# EAGLE design glucoschema (EAGLE 9.6.1)
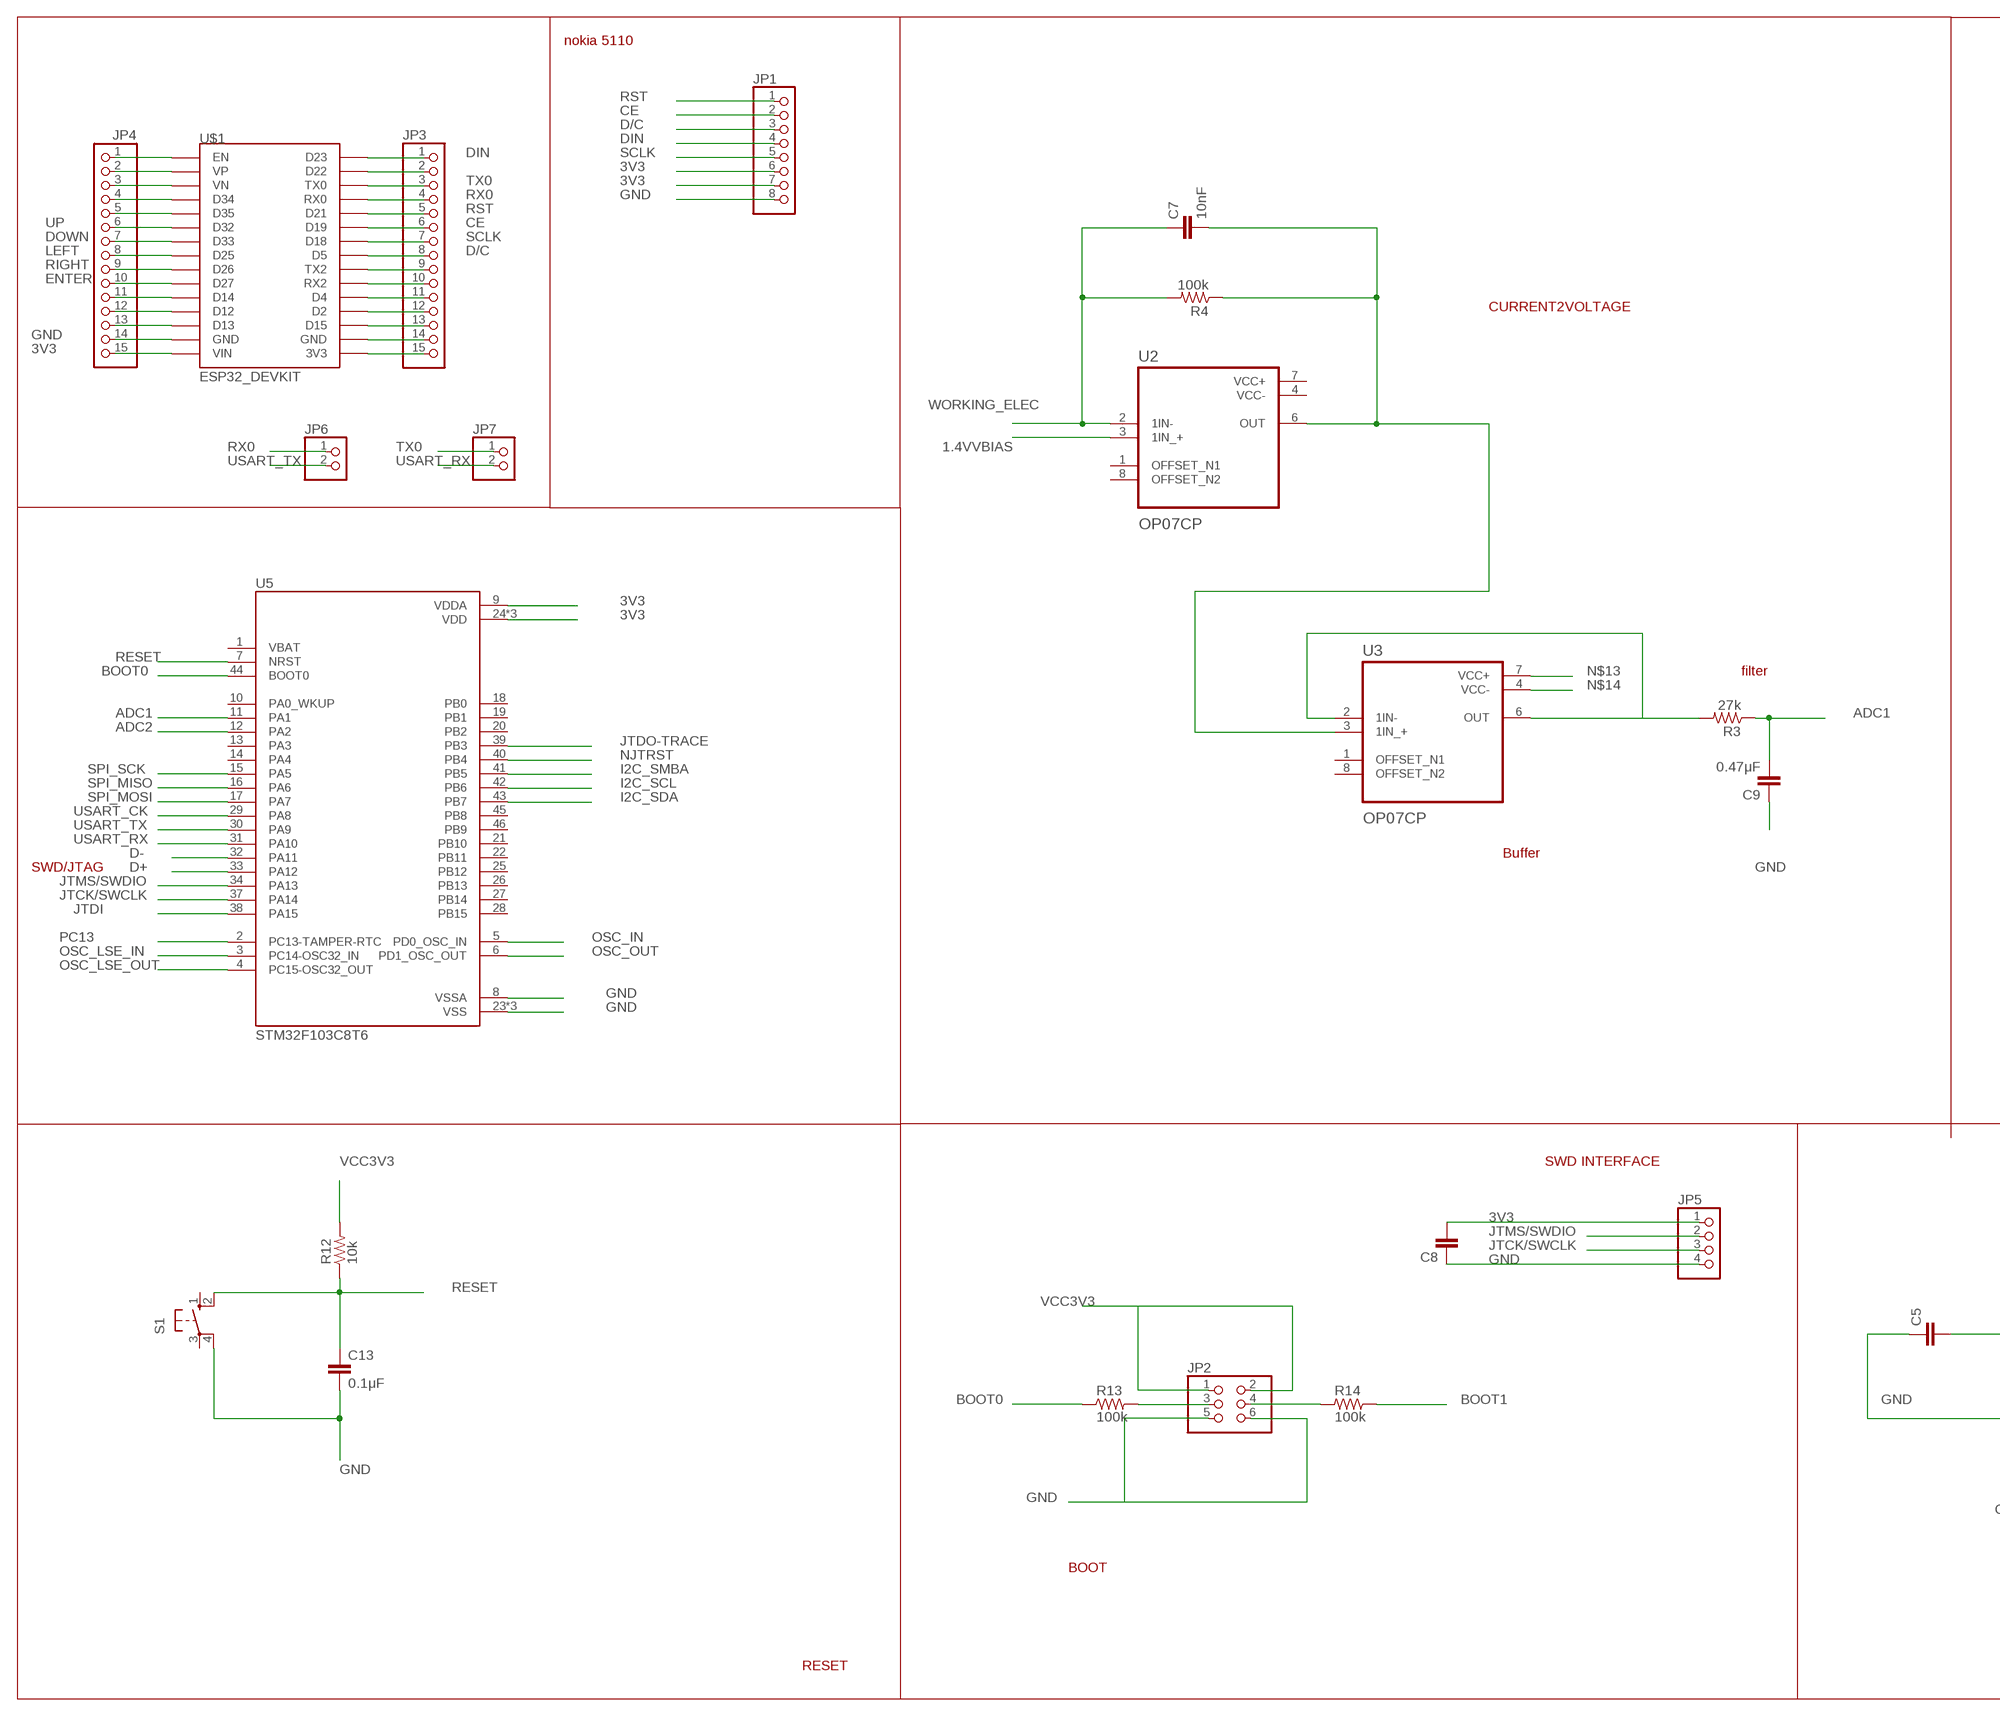
[diagram p0: schematic, sheet 1, part 1 of 2]
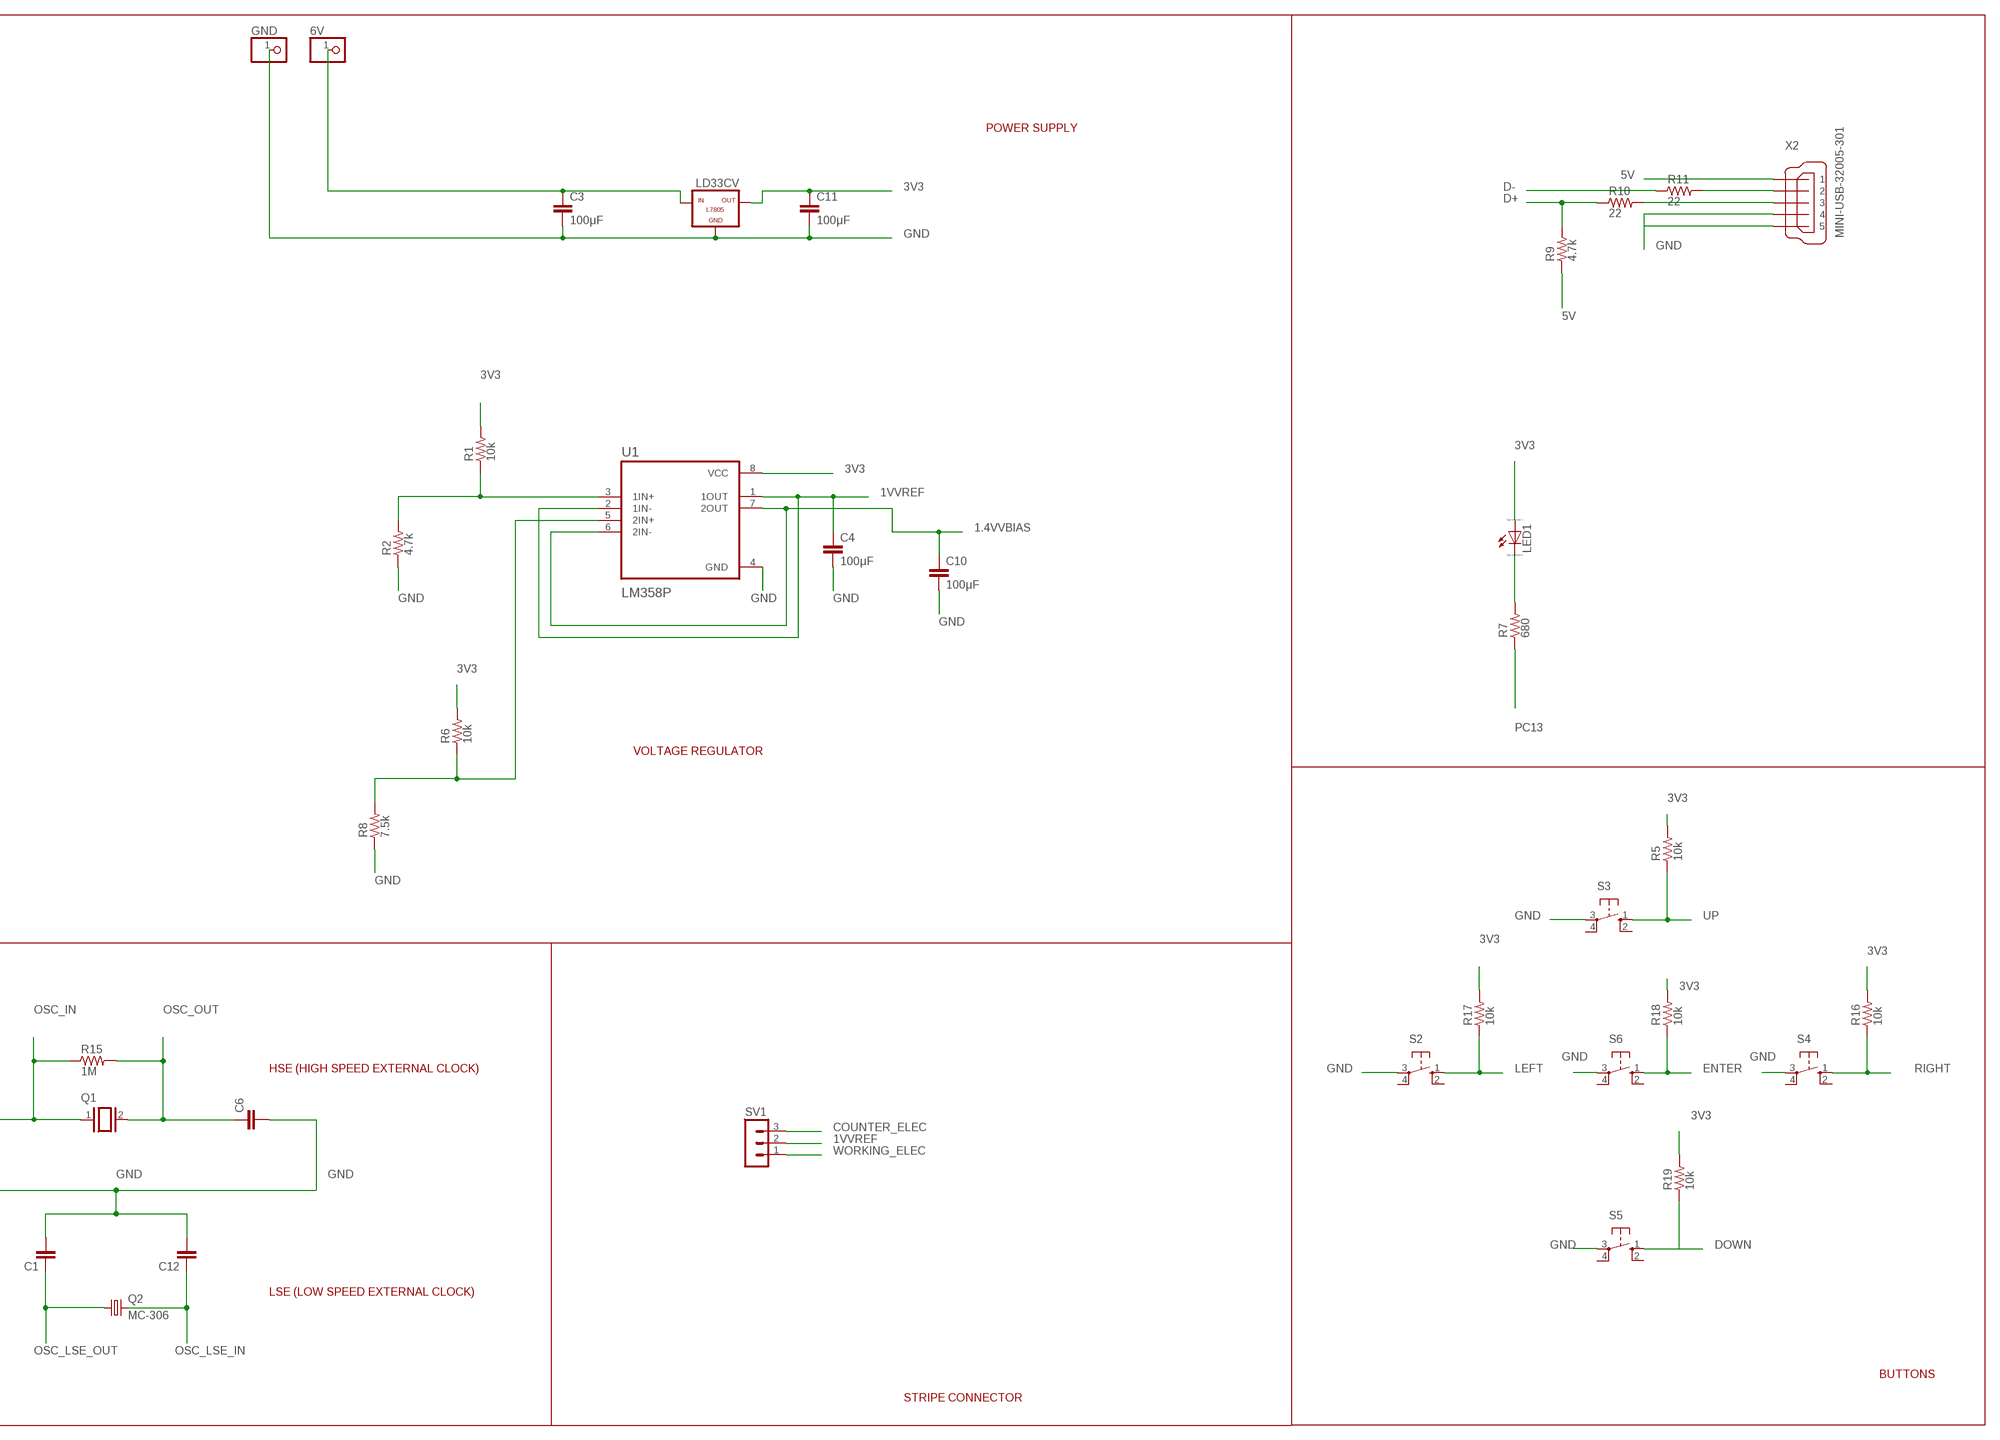
[diagram p1: schematic, sheet 1, part 2 of 2]

## Parts
6V  PINHD-1X1  [1X01]
C1  C2.5/4  [C2.5-4]
C3  100μF  C2.5/4  [C2.5-4]
C4  100μF  C2.5/4  [C2.5-4]
C5  C2.5/4  [C2.5-4]
C6  C2.5/4  [C2.5-4]
C7  10nF  C2.5/4  [C2.5-4]
C8  C2.5/4  [C2.5-4]
C9  0.47μF  C2.5/4  [C2.5-4]
C10  100μF  C2.5/4  [C2.5-4]
C11  100μF  C2.5/4  [C2.5-4]
C12  C2.5/4  [C2.5-4]
C13  0.1μF  C2.5/4  [C2.5-4]
GND  PINHD-1X1  [1X01]
JP1  PINHD-1X8  [1X08]
JP2  PINHD-2X3  [2X03]
JP3  PINHD-1X15  [1X15]
JP4  PINHD-1X15  [1X15]
JP5  PINHD-1X4  [1X04]
JP6  PINHD-1X2  [1X02]
JP7  PINHD-1X2  [1X02]
LD33CV  -L7805  [L7805]
LED1  LED_E  [LED_1206]
Q1  XTAL/S  [QS]
Q2  MC-306  [MC-306]
R1  10k  R_0805  [R0805]
R2  4.7k  R_0805  [R0805]
R3  27k  R_0805  [R0805]
R4  100k  R_0805  [R0805]
R5  10k  R_0805  [R0805]
R6  10k  R_0805  [R0805]
R7  680  R_0805  [R0805]
R8  7.5k  R_0805  [R0805]
R9  4.7k  R_0805  [R0805]
R10  22  R_0805  [R0805]
R11  22  R_0805  [R0805]
R12  10k  R_0805  [R0805]
R13  100k  R_0805  [R0805]
R14  100k  R_0805  [R0805]
R15  1M  R_0805  [R0805]
R16  10k  R_0805  [R0805]
R17  10k  R_0805  [R0805]
R18  10k  R_0805  [R0805]
R19  10k  R_0805  [R0805]
S1  10-XX  [B3F-10XX]
S2  10-XX  [B3F-10XX]
S3  10-XX  [B3F-10XX]
S4  10-XX  [B3F-10XX]
S5  10-XX  [B3F-10XX]
S6  10-XX  [B3F-10XX]
SV1  MA03-1  [MA03-1]
U1  LM358P  [DIP794W45P254L959H508Q8]
U2  OP07CP  [DIP794W45P254L959H508Q8]
U3  OP07CP  [DIP794W45P254L959H508Q8]
U5  STM32F103C8T6  [QFP50P900X900X160-48N]
U$1  ESP32_DEVKIT  [ESP32_DEVKIT]
X2  MINI-USB-32005-301  [32005-301]

## Nets
1.4VVBIAS: C10.1 U1.6(2IN-) U1.7(2OUT) U2.3(1IN_+)
1VVREF: C4.1 SV1.2 U1.1(1OUT) U1.2(1IN-)
3V1: LED1.C R7.2
3V3: C8.2 C11.1 JP1.6 JP1.7 JP4.15 JP5.1 LD33CV.OUT LED1.A R1.2 R5.2 R6.2 R16.2 R17.2 R18.2 R19.2 U1.8(VCC) U5.9(VDDA) U5.24(VDD) U5.36(VDD) U5.48(VDD) U$1.VIN
5V: R9.1 X2.1
ADC1: C9.2 R3.1 U5.11(PA1)
ADC2: U5.12(PA2)
BOOT0: R13.1 U5.44(BOOT0)
BOOT1: R14.2
CE: JP1.2 JP3.6 U$1.D19
COUNTER_ELEC: SV1.3
D+: R9.2 R10.1 U5.33(PA12)
D-: R11.1 U5.32(PA11)
D/C: JP1.3 JP3.8 U$1.D5
DIN: JP1.4 JP3.1 U$1.D23
DOWN: JP4.7 R19.1 S5.1(S) U$1.D33
ENTER: JP4.10 R18.1 S6.1(S) U$1.D27
GND: C1.2 C3.2 C4.2 C5.1 C6.2 C8.1 C9.1 C10.2 C11.2 C12.2 C13.2 GND.1 JP1.8 JP2.6 JP4.14 JP5.4 LD33CV.GND R2.1 R8.1 S1.4(P1) S2.3(P) S3.3(P) S4.3(P) S5.3(P) S6.3(P) U1.4(GND) U5.8(VSSA) U5.23(VSS) U5.35(VSS) U5.47(VSS) U$1.GND@1(GND) X2.4
I2C_SCL: U5.42(PB6)
I2C_SDA: U5.43(PB7)
I2C_SMBA: U5.41(PB5)
JTCK/SWCLK: JP5.3 U5.37(PA14)
JTDI: U5.38(PA15)
JTDO-TRACE: U5.39(PB3)
JTMS/SWDIO: JP5.2 U5.34(PA13)
LEFT: JP4.8 R17.1 S2.1(S) U$1.D25
N$1: R1.1 R2.2 U1.3(1IN+)
N$2: JP2.3 R13.2
N$3: JP2.4 R14.1
N$4: JP2.5
N$5: R6.1 R8.2 U1.5(2IN+)
N$6: JP2.1
N$8: JP4.13 U$1.D13
N$9: C7.2 R4.1 U2.6(OUT) U3.3(1IN_+)
N$10: JP4.12 U$1.D12
N$11: JP4.11 U$1.D14
N$13: U3.7(VCC+)
N$14: U3.4(VCC-)
N$19: JP4.5 U$1.D35
N$20: JP4.4 U$1.D34
N$21: JP4.3 U$1.VN
N$22: JP4.2 U$1.VP
N$23: JP4.1 U$1.EN
N$30: JP3.9 U$1.TX2
N$31: JP3.10 U$1.RX2
N$32: JP3.11 U$1.D4
N$33: JP3.12 U$1.D2
N$34: JP3.13 U$1.D15
N$35: JP3.14 U$1.GND@2(GND)
N$36: JP3.15 U$1.3V3
N$38: R11.2 X2.2
N$39: R10.2 X2.3
N$40: 6V.1 C3.1 LD33CV.IN
N$41: X2.5
N$1235AZE21: R3.2 U3.2(1IN-) U3.6(OUT)
NJTRST: U5.40(PB4)
OSC_IN: C5.2 Q1.1 R15.1 U5.5(PD0_OSC_IN)
OSC_LSE_IN: C12.1 Q2.4 U5.3(PC14-OSC32_IN)
OSC_LSE_OUT: C1.1 Q2.1 U5.4(PC15-OSC32_OUT)
OSC_OUT: C6.1 Q1.2 R15.2 U5.6(PD1_OSC_OUT)
PC13: R7.1 U5.2(PC13-TAMPER-RTC)
RESET: C13.1 R12.1 S1.2(S1) U5.7(NRST)
RIGHT: JP4.9 R16.1 S4.1(S) U$1.D26
RST: JP1.1 JP3.5 U$1.D21
RX0: JP3.4 JP6.1 U$1.RX0
SCL: JP3.2 U$1.D22
SCLK: JP1.5 JP3.7 U$1.D18
SPI_MISO: U5.16(PA6)
SPI_MOSI: U5.17(PA7)
SPI_SCK: U5.15(PA5)
TX0: JP3.3 JP7.1 U$1.TX0
UP: JP4.6 R5.1 S3.1(S) U$1.D32
USART_CK: U5.29(PA8)
USART_RX: JP7.2 U5.31(PA10)
USART_TX: JP6.2 U5.30(PA9)
VCC3V3: JP2.2 R12.2
WORKING_ELEC: C7.1 R4.2 SV1.1 U2.2(1IN-)
Unconnected: S1.1(S) S1.3(P) S2.2(S1) S2.4(P1) S3.2(S1) S3.4(P1) S4.2(S1) S4.4(P1) S5.2(S1) S5.4(P1) S6.2(S1) S6.4(P1) U2.1(OFFSET_N1) U2.8(OFFSET_N2) U3.1(OFFSET_N1) U3.8(OFFSET_N2) U5.1(VBAT) U5.10(PA0_WKUP) U5.13(PA3) U5.14(PA4) U5.18(PB0) U5.19(PB1) U5.20(PB2) U5.21(PB10) U5.22(PB11) U5.25(PB12) U5.26(PB13) U5.27(PB14) U5.28(PB15) U5.45(PB8) U5.46(PB9)

## Notes on the sheet
- nokia 5110
- POWER SUPPLY
- CURRENT2VOLTAGE
- filter
- Buffer
- SWD/JTAG
- VOLTAGE REGULATOR
- SWD INTERFACE
- HSE (HIGH SPEED EXTERNAL CLOCK)
- LSE (LOW SPEED EXTERNAL CLOCK)
- BOOT
- BUTTONS
- RESET | STRIPE CONNECTOR

## Power pins joined to a net without a drawn wire
VCC+: U2.7(VCC+)
VCC-: U2.4(VCC-)

## Library data of the parts
6V GND = pinhead:PINHD-1X1: PIN HEADER
C1 C3-C13 = capacitor-wima:C: CAPACITOR naming: grid - package width
JP1 = pinhead:PINHD-1X8: PIN HEADER
JP2 = pinhead:PINHD-2X3: PIN HEADER
JP3 JP4 = pinhead:PINHD-1X15: PIN HEADER
JP5 = pinhead:PINHD-1X4: PIN HEADER
JP6 JP7 = pinhead:PINHD-1X2: PIN HEADER
LD33CV = 7805:-L7805
LED1 = eagle-ltspice:LED_E: LED Source: http://www.osram.convergy.de Source: www.luxeon.com Source: www.kingbright.com; SPICEMODEL: NONE; SPICEPREFIX: D; SPICETYPE: diode
Q1 = special:XTAL/S: CRYSTAL
Q2 = crystal:MC-306: kHz RANGE CRYSTAL UNIT SMD Source: MC-306_405_406_E07X.PDF Homepage <http://www.epsontoyocom.co.jp>; MPN: MC-306 60.0KHZ 100PPM ,12.5PF; OC_FARNELL: 1278040; OC_NEWARK: 31M5576
R1-R19 = rc-master-smd:R_: RESISTOR
S1-S6 = switch-omron:10-XX: OMRON SWITCH; MPN: B3F-1000; OC_FARNELL: 176432; OC_NEWARK: 36M3542
SV1 = con-lstb:MA03-1: PIN HEADER; OC_FARNELL: unknown; OC_NEWARK: unknown
U1 = LM358P:LM358P: Check prices <https://snapeda.com/parts/LM358P/Texas%20Instruments/view-part/?ref=eda>; ARROW_ELECTRONICS-PURCHASE-URL: https://snapeda.com/shop?store=Arrow+Electronics&id=559457; AVAILABILITY: Good; DESCRIPTION: Dual standard operational amplifier 8-PDIP 0 to 70; DIGIKEY-PURCHASE-URL: https://snapeda.com/shop?store=DigiKey&id=559457; MF: Texas Instruments; MOUSER-PURCHASE-URL: https://snapeda.com/shop?store=Mouser&id=559457; MP: LM358P; PACKAGE: PDIP-8 Texas; PRICE: None; TEXAS_INSTRUMENTS-PURCHASE-URL: https://snapeda.com/shop?store=Texas+Instruments&id=559457
U2 U3 = OP07CP:OP07CP: Buy Part <https://snapeda.com/parts/OP07CP/Texas%20Instruments/view-part/?ref=eda>; AVAILABILITY: Good; DESCRIPTION: Low-Offset voltage (0.25mV) single operational amplifier 8-PDIP 0 to 70; DIGIKEY-PURCHASE-URL: https://snapeda.com/shop?store=DigiKey&id=558076; MF: Texas Instruments; MOUSER-PURCHASE-URL: https://snapeda.com/shop?store=Mouser&id=558076; MP: OP07CP; PACKAGE: PDIP-8 Texas Instruments; PRICE: None; TEXAS_INSTRUMENTS-PURCHASE-URL: https://snapeda.com/shop?store=Texas+Instruments&id=558076
U5 = STM32F103C8T6:STM32F103C8T6: Mainstream Performance line, ARM Cortex-M3 MCU with 64 Kbytes Flash, 72 MHz CPU, motor control, USB and CAN; AVAILABILITY: Unavailable; DESCRIPTION: ARM® Cortex®-M3 STM32F1 Microcontroller IC 32-Bit 72MHz 64KB (64K x 8) FLASH 48-LQFP (7x7); MF: STMicroelectronics; MP: STM32F103C8T6; PACKAGE: LQFP-48 STMicroelectronics; PRICE: None
U$1 = DOIT_ESP32_DEVKIT:ESP32_DEVKIT: ESP32 DEVKIT BOARD
X2 = con-cypressindustries:MINI-USB-: MINI USB-B Conector Source: www.cypressindustries.com; OC_FARNELL: unknown; OC_NEWARK: unknown

## Board
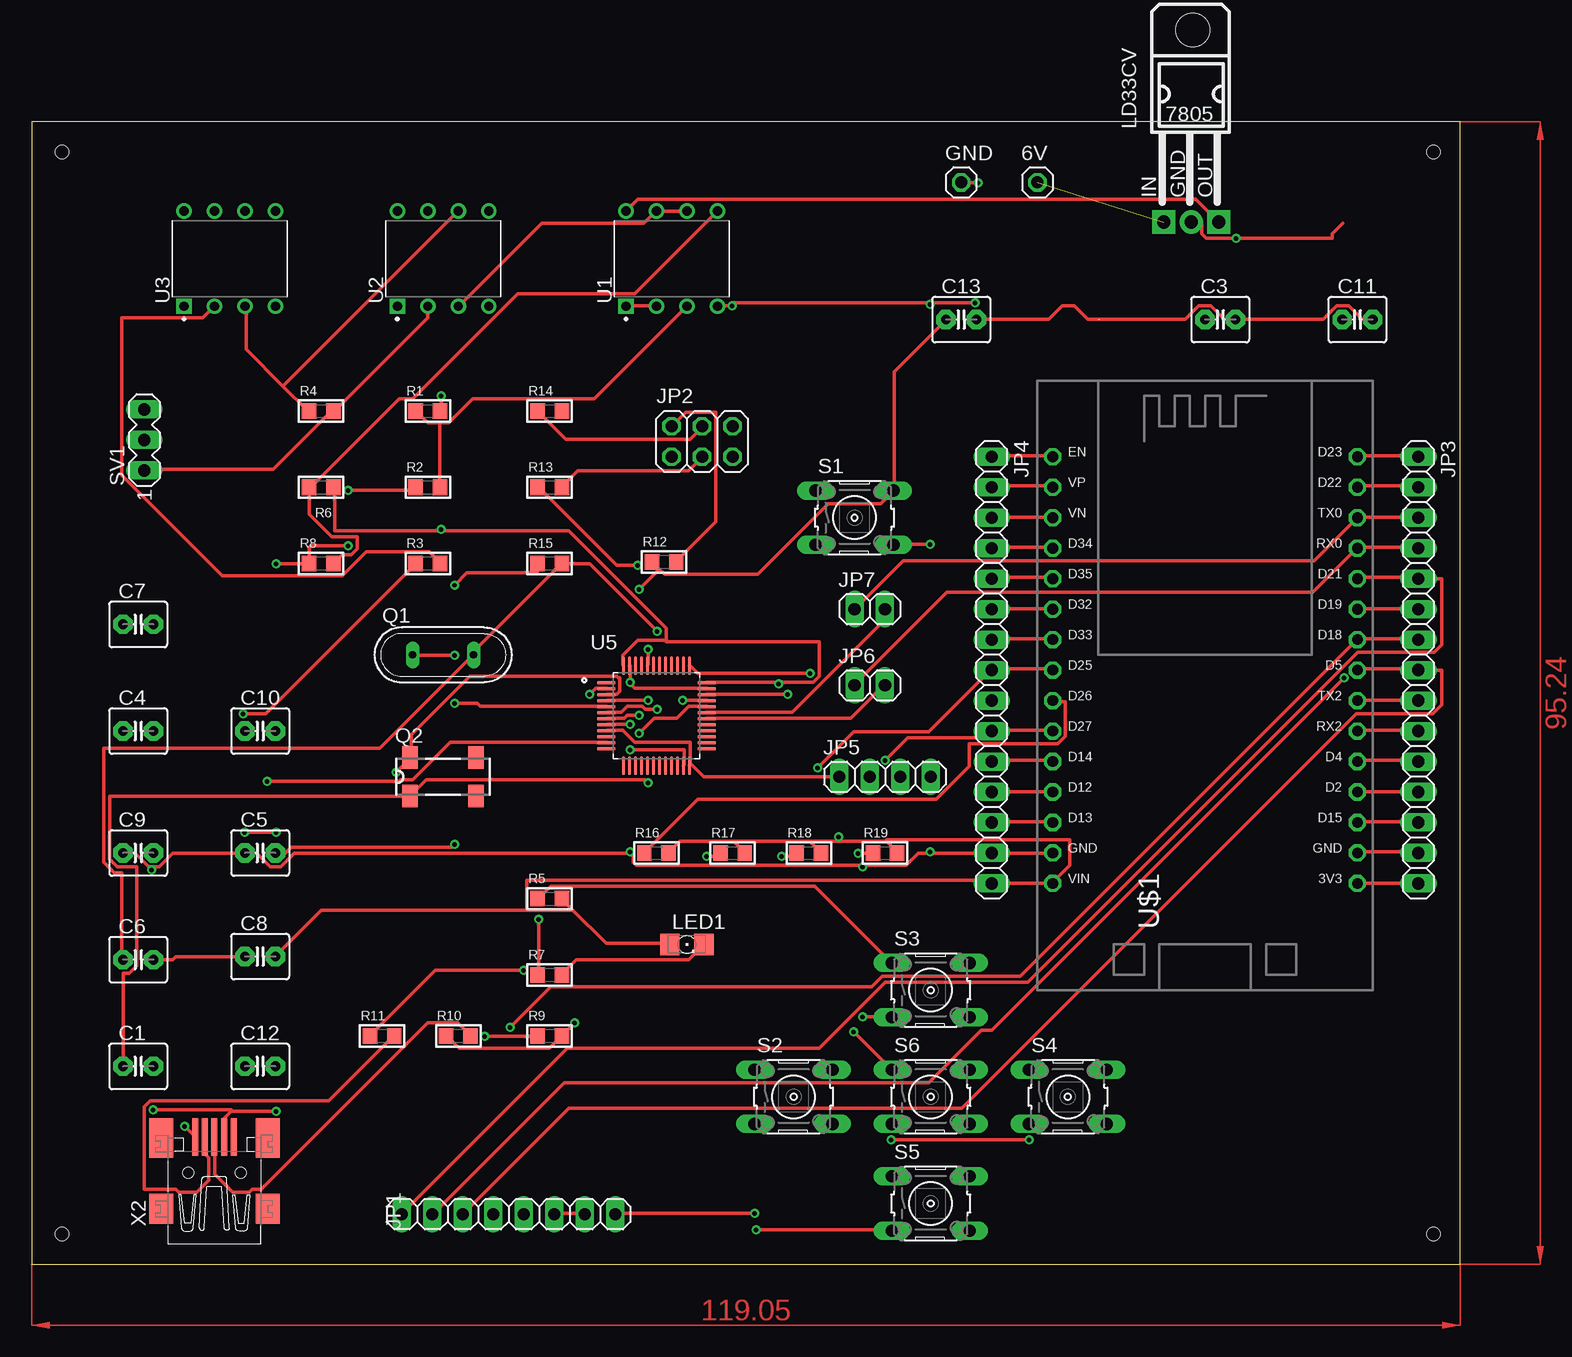
[diagram p2: board, top side]
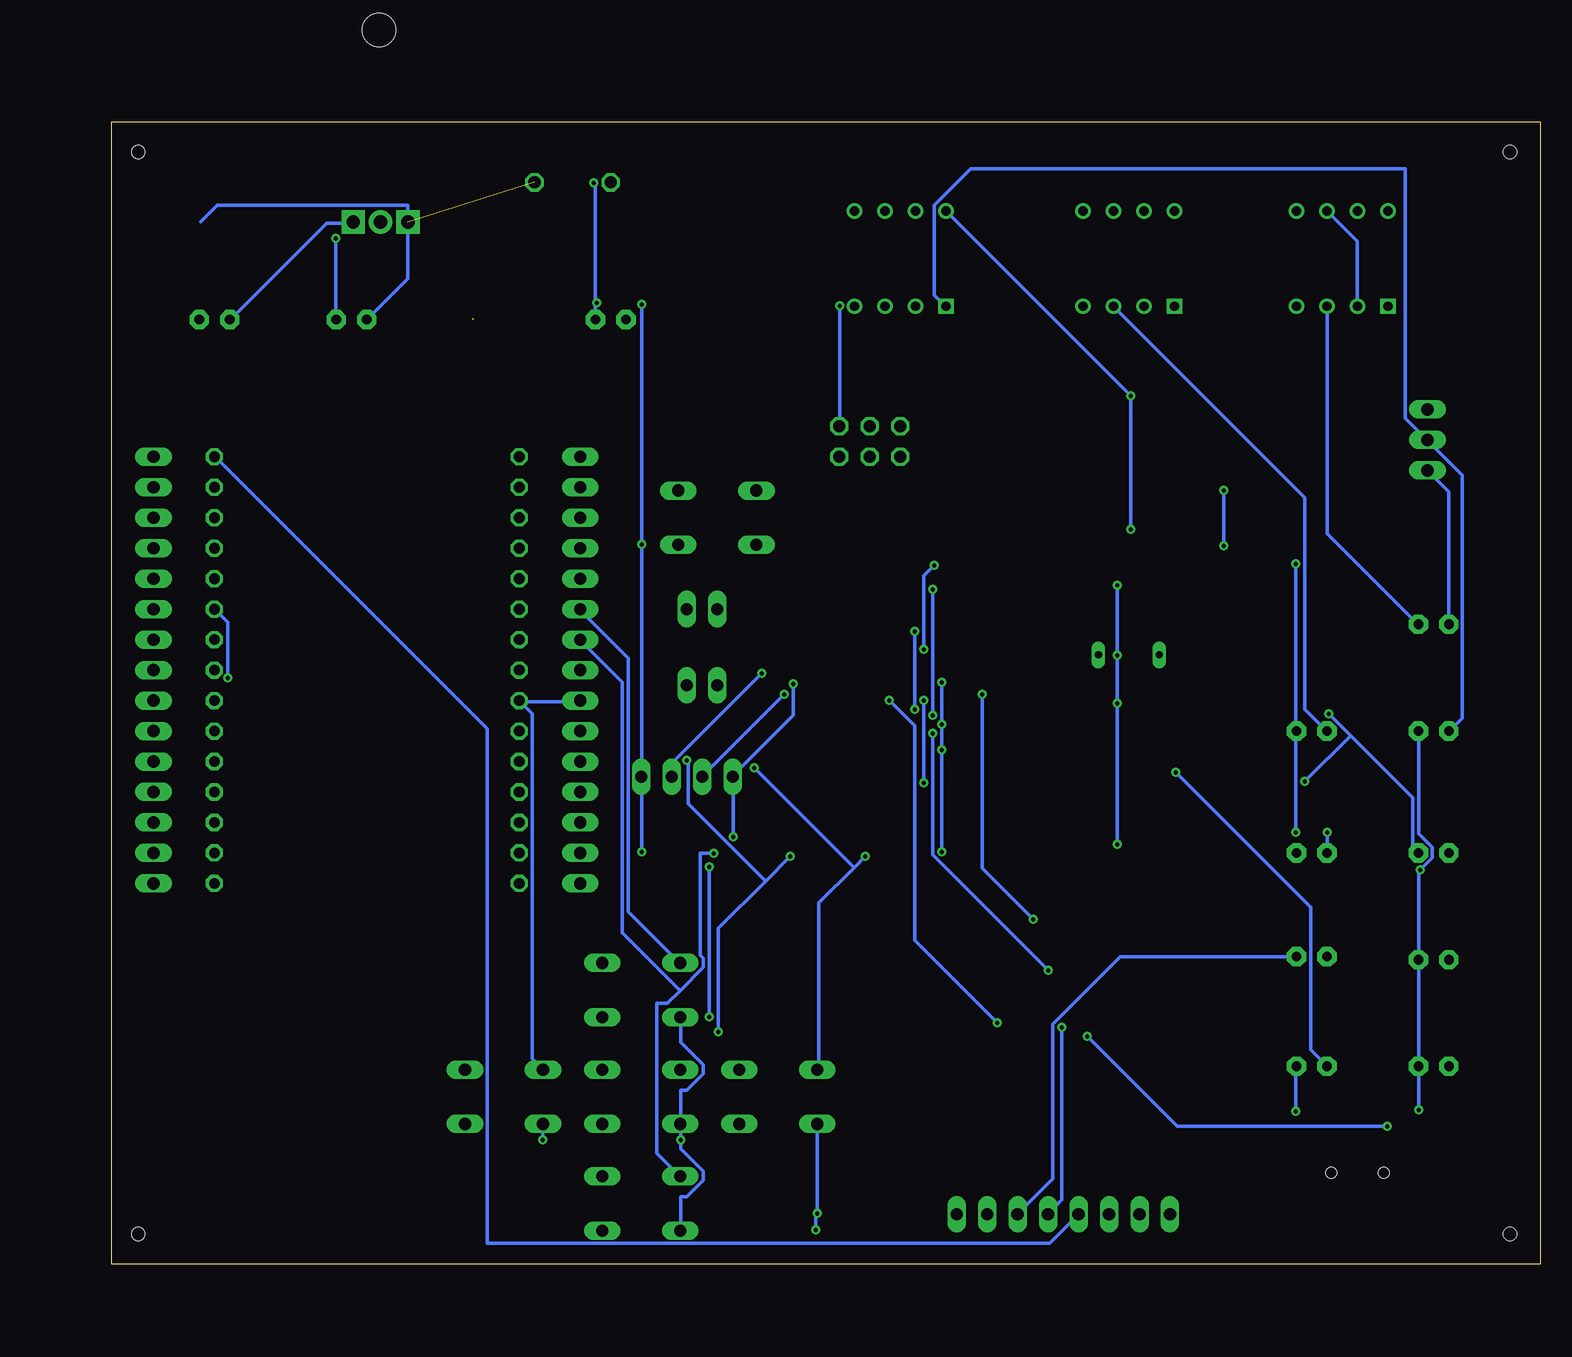
[diagram p3: board, bottom side, seen from below]

Size 119.05 x 95.24 mm. Coordinates in mm from the lower left corner, seen from the top.
Outline: 0,0 119.05,0 119.05,95.24 0,95.24 0,0
Copper layers (1*16): Top 0.035mm / dielectric 1.5mm / Bottom 0.035mm
Design rules "default *": minimum track width 0.3mm, minimum drill 0.35mm, track to track 6mil, track to pad 6mil, pad to pad 6mil, via to via 6mil, smd to smd 6mil, copper to edge 40mil, drill to drill 6mil, minimum pad ring 10mil, minimum via ring 8mil, stop-mask expansion 4mil, vias tented up to drill 0mil, thermal gap 10mil
Holes 1.1 mm at 2.54,92.71 2.54,2.54 116.84,2.54 116.84,92.71

### Footprints (pad centres in the part's own frame; a part is rotated, then mirrored left to right if it is on the bottom)
1X01 = drill 1.016 octagon: 1 0,0
C2.5-4 = drill 0.813 pad 1.6 octagon: 1 -1.27,0; 2 1.27,0
1X08 = drill 1.016 long: 1 -8.89,0; 2 -6.35,0; 3 -3.81,0; 4 -1.27,0; 5 1.27,0; 6 3.81,0; 7 6.35,0; 8 8.89,0
2X03 = drill 1.016 octagon: 1 -2.54,-1.27; 2 -2.54,1.27; 3 0,-1.27; 4 0,1.27; 5 2.54,-1.27; 6 2.54,1.27
1X15 = drill 1.016 long: 1 -17.78,0; 2 -15.24,0; 3 -12.7,0; 4 -10.16,0; 5 -7.62,0; 6 -5.08,0; 7 -2.54,0; 8 0,0; 9 2.54,0; 10 5.08,0; 11 7.62,0; 12 10.16,0; 13 12.7,0; 14 15.24,0; 15 17.78,0
1X04 = drill 1.016 long: 1 -3.81,0; 2 -1.27,0; 3 1.27,0; 4 3.81,0
1X02 = drill 1.016 long: 1 -1.27,0; 2 1.27,0
L7805 = drill 1.1 pad 1.93: GND 0.127,-9.652 | drill 1.1 pad 1.93 square: IN -2.159,-9.652; OUT 2.413,-9.652 | hole 2.8: 0.254,6.35
LED_1206 = smd 1.6 x 1.803: A -1.422,0; C 1.422,0
QS = drill 0.61 long: 1 -2.54,0; 2 2.54,0
MC-306 = smd 1.3 x 1.9: 1 -2.75,-1.6; 2 2.75,-1.6; 3 2.75,1.6; 4 -2.75,1.6
R0805 = smd 1.2 x 1.3: 1 -1.016,0; 2 1.016,0
B3F-10XX = drill 1.016 long: 1 -3.251,2.261; 2 3.251,2.261; 3 -3.251,-2.261; 4 3.251,-2.261
MA03-1 = drill 1.016 long: 1 -2.54,0; 2 0,0; 3 2.54,0
DIP794W45P254L959H508Q8 = drill 0.78 pad 1.13 square: 1 -3.97,3.81 | drill 0.78 pad 1.13: 2 -3.97,1.27; 3 -3.97,-1.27; 4 -3.97,-3.81; 5 3.97,-3.81; 6 3.97,-1.27; 7 3.97,1.27; 8 3.97,3.81
QFP50P900X900X160-48N = smd 1.56 x 0.28: 1 -4.18,2.75; 2 -4.18,2.25; 3 -4.18,1.75; 4 -4.18,1.25; 5 -4.18,0.75; 6 -4.18,0.25; 7 -4.18,-0.25; 8 -4.18,-0.75; 9 -4.18,-1.25; 10 -4.18,-1.75; 11 -4.18,-2.25; 12 -4.18,-2.75; 25 4.18,-2.75; 26 4.18,-2.25; 27 4.18,-1.75; 28 4.18,-1.25; 29 4.18,-0.75; 30 4.18,-0.25; 31 4.18,0.25; 32 4.18,0.75; 33 4.18,1.25; 34 4.18,1.75; 35 4.18,2.25; 36 4.18,2.75 | smd 0.28 x 1.56: 13 -2.75,-4.18; 14 -2.25,-4.18; 15 -1.75,-4.18; 16 -1.25,-4.18; 17 -0.75,-4.18; 18 -0.25,-4.18; 19 0.25,-4.18; 20 0.75,-4.18; 21 1.25,-4.18; 22 1.75,-4.18; 23 2.25,-4.18; 24 2.75,-4.18; 37 2.75,4.18; 38 2.25,4.18; 39 1.75,4.18; 40 1.25,4.18; 41 0.75,4.18; 42 0.25,4.18; 43 -0.25,4.18; 44 -0.75,4.18; 45 -1.25,4.18; 46 -1.75,4.18; 47 -2.25,4.18; 48 -2.75,4.18
ESP32_DEVKIT = drill 0.9 pad 1.422 octagon: 3V3 11.43,-17.78; D2 11.43,-10.16; D4 11.43,-7.62; D5 11.43,0; D12 -13.97,-10.16; D13 -13.97,-12.7; D14 -13.97,-7.62; D15 11.43,-12.7; D18 11.43,2.54; D19 11.43,5.08; D21 11.43,7.62; D22 11.43,15.24; D23 11.43,17.78; D25 -13.97,0; D26 -13.97,-2.54; D27 -13.97,-5.08; D32 -13.97,5.08; D33 -13.97,2.54; D34 -13.97,10.16; D35 -13.97,7.62; EN -13.97,17.78; GND@1 -13.97,-15.24; GND@2 11.43,-15.24; RX0 11.43,10.16; RX2 11.43,-5.08; TX0 11.43,12.7; TX2 11.43,-2.54; VIN -13.97,-17.78; VN -13.97,12.7; VP -13.97,15.24
32005-301 = smd 3.1 x 0.5: 1 3,1.6; 2 3,0.8; 3 3,0; 4 3,-0.8; 5 3,-1.6 | smd 2.5 x 2: M1 -3,-4.45; M2 -3,4.45 | smd 3.3 x 2: M3 2.9,4.45; M4 2.9,-4.45 | hole 0.9: 0,2.2; 0,-2.2

### Placement (x,y rotation side)
6V  83.82,90.17 0 top
C1  8.89,16.51 0 top
C3  99.06,78.74 0 top
C4  8.89,44.45 0 top
C5  19.05,34.29 0 top
C6  8.89,25.4 0 top
C7  8.89,53.34 0 top
C8  19.05,25.65 0 top
C9  8.89,34.29 0 top
C10  19.05,44.45 0 top
C11  110.49,78.74 0 top
C12  19.05,16.51 0 top
C13  77.47,78.74 0 top
GND  77.47,90.17 0 top
JP1  39.75,4.19 0 top
JP2  55.88,68.58 0 top
JP3  115.57,49.53 270 top
JP4  80.01,49.53 270 top
JP5  71.12,40.64 0 top
JP6  69.85,48.26 0 top
JP7  69.85,54.61 0 top
LD33CV  96.52,96.52 0 top
LED1  54.61,26.67 0 top
Q1  34.29,50.8 0 top
Q2  34.29,40.64 0 top
R1  33.02,71.12 0 top
R2  33.02,64.77 0 top
R3  33.02,58.42 0 top
R4  24.13,71.12 0 top
R5  43.18,30.48 0 top
R6  24.13,64.77 0 top
R7  43.18,24.13 0 top
R8  24.13,58.42 0 top
R9  43.18,19.05 0 top
R10  35.56,19.05 0 top
R11  29.21,19.05 0 top
R12  52.7,58.55 0 top
R13  43.18,64.77 0 top
R14  43.18,71.12 0 top
R15  43.18,58.42 0 top
R16  52.07,34.29 0 top
R17  58.42,34.29 0 top
R18  64.77,34.29 0 top
R19  71.12,34.29 0 top
S1  68.58,62.23 0 top
S2  63.5,13.97 0 top
S3  74.93,22.86 0 top
S4  86.36,13.97 0 top
S5  74.93,5.08 0 top
S6  74.93,13.97 0 top
SV1  9.4,68.71 90 top
U1  53.34,83.82 90 top
U2  34.29,83.82 90 top
U3  16.51,83.82 90 top
U5  52.07,45.72 0 top
U$1  99.06,49.53 0 top
X2  15.24,7.62 90 top

### Tracks (layer width: path | path; a pad name or v marks a point on that pad's centre or on a via)
1.4VVBIAS
  Top 0.3: U2.3 35.62,79.88 42.5,86.75 51,86.75 52,87.75 U1.7 52.12,87.75 54.5,87.75 U1.6
  Bottom 0.3: C10.1 17.88,44.5 19.62,46.25 19.62,63.88 35.5,79.75 U2.3
1VVREF
  Top 0.3: U1.1 49.62,79.88 52,79.88 U1.2
  Bottom 0.3: C4.1 7.5,44.5 6.5,45.5 6.5,65.75 9.38,68.62 SV1.2 9.5,68.75 11.25,70.5 11.25,91.29 47.46,91.29 50.5,88.25 50.5,80.75 49.62,79.88 U1.1
3V1
  Top 0.3: R7.2 44.25,24.25 45.38,25.38 54.75,25.38 56,26.62 LED1.C
3V3  (via drill 0.35)
  Top 0.3: v34.12,72.38 34.12,71.12 R1.2 | LD33CV.OUT 98.88,86.88 97,88.75 50.5,88.75 49.62,87.88 U1.8 | JP1.6 43.62,4.25 46,4.25 JP1.7 | 45.06,29.56 47.88,26.75 53.12,26.75 LED1.A | 45.06,29.56 44.25,30.38 R5.2 | 41.25,29.5 45,29.5 45.06,29.56 | 41.25,29.5 24.12,29.5 20.38,25.75 C8.2 | 54.88,41.62 54.88,43.5 50.25,43.5 49.25,44.5 48,44.5 U5.9 | 54.88,41.62 U5.24 | JP5.1 67.25,40.62 56,40.62 55,41.62 54.88,41.62 | 58.5,35.25 54,35.25 53.12,34.38 R16.2 | 58.5,35.25 59.38,34.38 R17.2 | 64.94,35.19 64.88,35.25 58.5,35.25 | 64.94,35.19 65.75,34.38 R18.2 | 71.25,35.25 72.12,34.38 R19.2 | 67.25,35.25 65,35.25 64.94,35.19 | 67.25,35.25 71.25,35.25 | 71.25,35.25 71.25,35.38 86.5,35.38 86.5,33.25 85.12,31.88 U$1.VIN JP4.15 79.88,31.75 79.62,32 41.25,32 41.25,29.5 | 67.25,35.25 v67.25,35.62 | 34.12,61.12 44.75,61.12 52.88,53 52.88,52 | 34.12,61.12 25.25,61.12 25.25,64.75 R6.2 | 52.88,52 50.5,52 49.25,50.75 49.25,50 U5.48 | 62.25,48.5 65.12,48.5 65.62,49 65.62,51.88 52.88,51.88 52.88,52 | 62.25,48.5 56.25,48.5 U5.36 | v62.25,48.38 62.25,48.5 | v34.12,61.25 34.12,61.12
  Bottom 0.3: C11.1 109.12,78.75 101.12,86.75 99,86.75 LD33CV.OUT | U1.8 49.5,87.75 v34.12,72.38 v34.12,61.25 | JP1.6 43.5,4.25 40.62,7.12 40.62,20 35,25.62 20.38,25.62 C8.2 | v67.25,35.62 67.25,40.62 JP5.1 67.25,40.75 62.25,45.75 v62.25,48.38
5V  (via drill 0.35)
  Top 0.3: v37.75,19 42.12,19 R9.1 | v12.75,11.5 13.62,10.62 X2.1
  Bottom 0.3: v37.75,19 30.25,11.5 v12.75,11.5
ADC1  (via drill 0.35)
  Top 0.3: v17.62,45.88 19.5,45.88 32,58.38 R3.1 | v19.62,40.25 30.62,40.25 30.75,40.38 31.75,40.38 34.88,43.5 47.88,43.5 U5.11
  Bottom 0.3: 15.81,44.06 10.62,38.88 10.62,34.75 10.25,34.38 C9.2 | 15.81,44.06 v17.62,45.88 | 15.81,44.06 v19.62,40.25
BOOT0  (via drill 0.35)
  Top 0.3: v50.5,58.25 48.75,58.25 42.25,64.75 R13.1 | v51.38,51.25 51.38,50 U5.44
  Bottom 0.3: v50.5,58.25 51.38,57.38 v51.38,51.25
CE  (via drill 0.35)
  Top 0.3: U$1.D19 110.5,54.62 115.5,54.62 JP3.6 | v109.38,48.88 80,19.5 79.12,19.5 74.75,15.12 44.38,15.12 33.5,4.25 JP1.2
  Bottom 0.3: v109.38,48.88 109.38,53.5 110.38,54.5 U$1.D19
D+  (via drill 0.35)
  Top 0.3: R10.1 34.62,19 35.62,18 43.12,18 44.12,19 R9.2 44.25,19.12 v45.25,20.12 | v54.25,47 56.25,47 U5.33
  Bottom 0.3: v54.25,47 52.12,44.88 52.12,27 v45.25,20.12
D-  (via drill 0.35)
  Top 0.3: v41,24.5 33.62,24.5 28.25,19.12 R11.1 | v50.62,44.25 51.88,45.5 53.75,45.5 54.75,46.5 56.25,46.5 U5.32
  Bottom 0.3: v41,24.5 50.62,34.12 v50.62,44.25
D/C
  Top 0.3: U$1.D5 110.5,49.62 115.5,49.62 JP3.8 115.62,49.5 117.5,49.5 117.5,46.62 116.75,45.88 110.38,45.88 77.5,13 44.75,13 JP1.3
DIN
  Top 0.3: U$1.D23 110.5,67.38 115.5,67.38 JP3.1
  Bottom 0.3: JP1.4 38.5,4.12 40.88,1.75 87.75,1.75 87.75,44.62 110.38,67.25 U$1.D23
DOWN  (via drill 0.35)
  Top 0.3: U$1.D33 85,52.12 80.12,52.12 JP4.7 | v68.88,34.25 70,34.25 R19.1
  Bottom 0.3: v68.88,34.25 70,34.25 70,25.75 69.75,25.5 69.75,24.75 71.69,22.81 | 71.69,22.81 72.75,21.75 73.62,21.75 73.62,9.25 71.75,7.38 S5.1 | 71.69,22.81 76.5,27.62 76.5,48.5 80,52 JP4.7
ENTER  (via drill 0.35)
  Top 0.3: U$1.D27 85,44.5 80.12,44.5 JP4.10 79.88,44.5 79.25,43.88 73,43.88 v71.12,42 | v62.5,34 63.5,34 63.75,34.25 R18.1 | v68.5,19.38 71.62,16.25 S6.1
  Bottom 0.3: 64.56,31.94 68.5,28 v68.5,19.38 | 64.56,31.94 v62.5,34 | v71.12,42 71,41.88 71,38.38 64.56,31.94
GND  (via drill 0.35)  (1 unrouted)
  Top 0.3: 109.25,86.75 108.38,85.88 108.38,85.5 v100.38,85.5 97.88,85.5 97.5,85.88 97.5,86.88 96.75,86.88 LD33CV.GND | U1.4 57.25,79.88 v58.38,79.88 58.38,80 58.5,80.12 74.88,80.12 | 88.88,78.75 88,78.75 86.88,79.88 85.88,79.88 84.75,78.75 C13.2 | 89,78.75 96.12,78.75 97.25,79.88 98.25,79.88 99.38,78.75 100.25,78.75 C3.2 100.38,78.75 107.62,78.75 108.75,79.88 109.75,79.88 110.88,78.75 C11.2 | v78.88,90.12 77.5,90.12 GND.1 | v78.62,80.12 74.88,80.12 | v60.25,4.25 48.75,4.25 JP1.8 | v71.62,10.38 v83.12,10.38 | v60.38,2.88 71.62,2.88 S5.3 | 16.62,12.75 16,12.12 16,10.62 X2.4 | v20.38,12.75 16.62,12.75 | C8.1 17.75,25.62 12,25.62 11.75,25.38 10.25,25.38 C6.2 | v10.12,12.88 16.62,12.88 16.62,12.75 | v20.38,58.38 23,58.38 R8.1 23.12,58.5 23.12,59.75 23.25,59.88 v26.38,59.88 | v26.38,64.5 32,64.5 32,64.75 R2.1 | v49.88,45 48,45 U5.8 | U5.47 49.88,49.88 v49.88,48.5 49.88,48.38 50.25,48 56.25,48 U5.35 | v49.88,42.88 54.38,42.88 54.38,41.62 U5.23 | 10,33.12 9.75,33.12 8.62,34.25 7.62,34.25 C9.1 | 10,33.12 10.62,33.12 11.75,34.25 17.75,34.25 C5.1 17.88,34.25 18.75,34.25 19.88,33.12 20.75,33.12 21.88,34.25 49.88,34.25 | 74.88,34.25 73.88,34.25 72.88,33.25 69.25,33.25 | 74.88,34.25 80,34.25 JP4.14 80.12,34.25 85,34.25 U$1.GND@1 | 69.25,33.25 50.38,33.25 50.12,33.5 50.12,34.25 49.88,34.25 | v74.88,34.38 74.88,34.25 | v74.88,60 71.88,60 S1.4 | v49.88,34.38 49.88,34.25 | v17.75,36 v20.38,36 | v10,32.88 10,33.12 | v69.25,20.62 71.62,20.62 S3.3 | v69.25,33.12 69.25,33.25 | v74.88,80 74.88,80.12
  Bottom 0.3: v58.38,79.88 58.38,69.88 JP2.6 | v78.88,90.12 78.75,90 78.75,80.12 | 78.75,80.12 C13.2 | v78.62,80.12 78.75,80.12 | v100.38,85.5 100.38,78.75 C3.2 | S2.3 60.25,11.62 v60.25,4.25 60.38,4.25 v60.38,2.88 | S5.3 71.62,2.88 71.62,5.62 71.12,5.62 69.75,7 69.75,7.75 71.62,9.62 v71.62,10.38 71.62,11.62 S6.3 71.62,11.75 71.62,14.5 71.12,14.5 69.75,15.88 69.75,16.62 71.62,18.5 71.62,20.5 S3.3 | v83.12,10.38 83.12,11.62 S4.3 | v20.38,12.75 20.38,16.5 C12.2 | C4.2 10.12,44.38 10.12,35.88 9,34.75 9,33.88 v10,32.88 10.12,32.75 10.12,25.5 C6.2 10.12,25.38 10.12,16.62 C1.2 10.12,16.38 v10.12,12.88 | v20.38,58.38 20.38,44.5 C10.2 20.38,44.38 v20.38,36 | v26.38,59.88 v26.38,64.5 | v49.88,48.5 v49.88,45 v49.88,42.88 v49.88,34.38 | v74.88,34.38 74.88,40.62 JP5.4 74.88,40.75 v74.88,60 v74.88,80 | v17.75,36 17.75,34.38 C5.1 | v69.25,33.12 v69.25,20.62
JTCK/SWCLK  (via drill 0.35)
  Top 0.3: v64.88,49.25 55.5,49.25 54.88,49.88 U5.37
  Bottom 0.3: v64.88,49.25 72.38,41.75 72.38,40.75 JP5.3
JTMS/SWDIO  (via drill 0.35)
  Top 0.3: v63,47.5 56.25,47.5 U5.34
  Bottom 0.3: v63,47.5 69.75,40.75 JP5.2
LEFT  (via drill 0.35)
  Top 0.3: U$1.D25 85,49.62 80.12,49.62 JP4.8 79.88,49.5 74.75,44.38 68.5,44.38 v65.5,41.38 | v56.25,34 57.12,34 57.38,34.25 R17.1
  Bottom 0.3: 57.19,33.06 60.12,30.12 60.12,16.25 S2.1 | 57.19,33.06 v56.25,34 | 57.19,33.06 v65.5,41.38
N$1
  Top 0.3: 34,70.12 34,64.88 R2.2 | 34,70.12 33,70.12 32.12,71 R1.1 | 34,70.12 34.75,70.12 36.75,72.12 46.88,72.12 54.5,79.75 U1.3
N$2
  Top 0.3: R13.2 44.25,64.88 45.5,66.12 54.75,66.12 55.88,67.25 JP2.3
N$3
  Top 0.3: R14.1 42.25,71 44.5,68.75 54.88,68.75 55.88,69.75 JP2.4
N$5
  Top 0.3: R8.2 25.25,58.5 25.88,59.12 26.62,59.12 27.12,59.62 27.12,60.62 25,60.62 23.12,62.5 23.12,64.75 R6.1 23.25,64.75 30.62,72.12 31.75,72.12 40.5,80.88 50.25,80.88 57.12,87.75 U1.5
N$8
  Top 0.3: U$1.D13 85,36.88 80.12,36.88 JP4.13
N$9
  Top 0.3: 20.94,73.19 17.88,76.25 17.88,79.75 U3.3 | 20.94,73.19 23,71.12 R4.1 | 20.94,73.19 35.5,87.75 U2.6
  Bottom 0.3: C7.2 10.25,53.38 17.75,60.88 17.75,79.75 U3.3
N$10
  Top 0.3: U$1.D12 85,39.38 80.12,39.38 JP4.12
N$11
  Top 0.3: U$1.D14 85,42 80.12,42 JP4.11
N$19
  Top 0.3: U$1.D35 85,57.25 80.12,57.25 JP4.5
N$20
  Top 0.3: U$1.D34 85,59.75 80.12,59.75 JP4.4
N$21
  Top 0.3: U$1.VN 85,62.25 80.12,62.25 JP4.3
N$22
  Top 0.3: U$1.VP 85,64.88 80.12,64.88 JP4.2
N$23
  Top 0.3: U$1.EN 85,67.38 80.12,67.38 JP4.1
N$30
  Top 0.3: U$1.TX2 115.5,47 JP3.9
N$31
  Top 0.3: U$1.RX2 110.5,44.5 115.5,44.5 JP3.10
N$32
  Top 0.3: U$1.D4 110.5,42 115.5,42 JP3.11
N$33
  Top 0.3: U$1.D2 115.5,39.38 JP3.12
N$34
  Top 0.3: U$1.D15 110.5,36.88 115.5,36.88 JP3.13
N$35
  Top 0.3: U$1.GND@2 110.5,34.38 115.5,34.38 JP3.14
N$36
  Top 0.3: JP3.15 U$1.3V3
N$38
  Top 0.3: R11.2 30.12,19 24.75,13.62 9.88,13.62 9.38,13.12 9.38,6.25 12,6.25 12.25,6 13.75,6 14.75,7 14.75,8.88 14.5,9.12 14.5,10.5 X2.2
N$39
  Top 0.3: R10.2 36.5,19.12 35.5,20.12 33,20.12 19.12,6.25 18.38,6.25 18.12,6 16.75,6 15.25,7.5 15.25,10.5 X2.3
N$40  (1 unrouted)
  Bottom 0.3: C3.1 97.75,78.75 94.38,82.12 94.38,86.75 LD33CV.IN 94.38,87 94.38,88.25 110.25,88.25 111.62,86.88
N$1235AZE21
  Top 0.3: R3.2 34,58.5 33.12,59.38 27.88,59.38 25.88,57.38 15.88,57.38 7.5,65.75 7.5,78.88 14.25,78.88 15.12,79.75 U3.2
  Bottom 0.3: U3.6 17.75,87.75 15.25,85.25 15.25,79.88 U3.2
OSC_IN  (via drill 0.35)
  Top 0.3: v35.25,56.6 36.27,57.62 42.12,57.62 42.12,58.38 R15.1 | v35.25,50.75 31.75,50.75 Q1.1 | v35.25,46.75 37.12,46.75 37.38,46.5 47.88,46.5 U5.5 | v35.25,35 35,34.75 21.62,34.75 21.12,34.25 20.38,34.25 C5.2
  Bottom 0.3: v35.25,56.6 v35.25,50.75 v35.25,46.75 v35.25,35
OSC_LSE_IN  (via drill 0.35)
  Top 0.3: U5.3 48,47.5 48.75,47.5 49,47.75 49,48.88 48.88,48.88 48.75,49 36.5,49 31.62,44.12 31.62,42.25 Q2.4 31.5,42.12 v30.38,41
  Bottom 0.3: v30.38,41 19.12,29.75 19.12,17.88 17.88,16.62 C12.1
OSC_LSE_OUT  (via drill 0.35)
  Top 0.3: v51.38,47 48,47 U5.4 | v51.38,40.12 51.12,40.38 32.88,40.38 Q2.1 31.5,39 6.5,39 6.5,33.75 7.12,33.12 8.75,33.12 8.75,24.88 8.12,24.25 7.62,24.25 7.62,16.62 C1.1
  Bottom 0.3: v51.38,40.12 v51.38,47
OSC_OUT  (via drill 0.35)
  Top 0.3: v52.12,46.25 51.12,46.25 50.88,46.5 49.62,46.5 49.12,46 48,46 U5.6 | v52.12,52.75 46.5,58.38 44.25,58.38 R15.2 44.12,58.38 36.88,51.12 36.88,50.88 Q1.2 36.75,50.75 29,43 6,43 6,33.5 6.88,32.62 7.5,32.62 7.5,25.5 C6.1
  Bottom 0.3: v52.12,52.75 v52.12,46.25
PC13  (via drill 0.35)
  Top 0.3: v42.25,28.75 42.25,24.25 R7.1 | v46.5,47.5 47,48 47.88,48 U5.2
  Bottom 0.3: v42.25,28.75 46.5,33 v46.5,47.5
RESET  (via drill 0.35)
  Top 0.3: 52.31,57.94 52.75,57.5 60.5,57.5 66.38,63.38 70.75,63.38 71.75,64.38 S1.2 71.88,64.62 71.88,74.38 76.12,78.62 C13.1 | 52.31,57.94 51.75,58.5 R12.1 | v50.62,45.75 49.62,45.75 49.38,45.5 48,45.5 U5.7 | 52.31,57.94 v50.62,56.25
  Bottom 0.3: v50.62,56.25 v50.62,45.75
RIGHT
  Top 0.3: R16.1 51.12,34.38 55.5,38.75 75.38,38.75 78.12,41.5 78.12,43.38 85.5,43.38 86.12,44 86.12,46.88 85.12,46.88 U$1.D26
  Bottom 0.3: S4.1 83.12,16.25 84,17.12 84,45.88 85,46.88 U$1.D26 84.88,46.88 80.12,46.88 JP4.9
RST
  Top 0.3: U$1.D21 110.5,57.25 115.5,57.25 JP3.5 115.62,57.12 117.5,57.12 117.5,51.62 116.88,51 110.5,51 83,23.5 71.12,23.5 65.62,18 44.62,18 30.88,4.25 JP1.1
RX0
  Top 0.3: JP3.4 115.5,59.75 110.5,59.75 U$1.RX0 110.38,59.62 106.75,56 76.25,56 68.62,48.38 JP6.1
SCL
  Top 0.3: U$1.D22 110.5,64.88 115.5,64.88 JP3.2
SCLK  (via drill 0.35)
  Top 0.3: JP3.7 115.5,52.12 110.5,52.12 U$1.D18 110.38,52 82.38,24 70.88,24 70,23.12 43.25,23.12 v39.88,19.75
  Bottom 0.3: v39.88,19.75 39.88,5.38 41,4.25 JP1.5
TX0
  Top 0.3: JP3.3 115.5,62.25 110.5,62.25 U$1.TX0 110.38,62.12 106.88,58.62 72.62,58.62 68.62,54.62 JP7.1
UP
  Top 0.3: U$1.D32 85,54.62 80.12,54.62 JP4.6 | R5.1 42.25,30.5 43.25,31.5 65.25,31.5 71.62,25.12 S3.1
  Bottom 0.3: JP4.6 80,54.5 76,50.5 76,29.38 71.75,25.12 S3.1
USART_RX
  Top 0.3: U5.31 56.25,46 63.38,46 71,53.62 71,54.5 JP7.2
USART_TX
  Top 0.3: U5.30 56.25,45.5 68.25,45.5 71,48.25 JP6.2
VCC3V3
  Top 0.3: R12.2 53.75,58.62 57,61.88 57,71 54.5,71 53.38,69.88 JP2.2
WORKING_ELEC
  Top 0.3: U2.2 33,79.75 33,78.88 25.25,71.12 R4.2 25,71.12 20.12,66.25 9.5,66.25 SV1.1
  Bottom 0.3: SV1.1 9.38,66.12 7.62,64.38 7.62,53.38 C7.1
(copper drawn outside any net)
  shapes: Top area x2